# Altium project hardmotor.PrjPcb
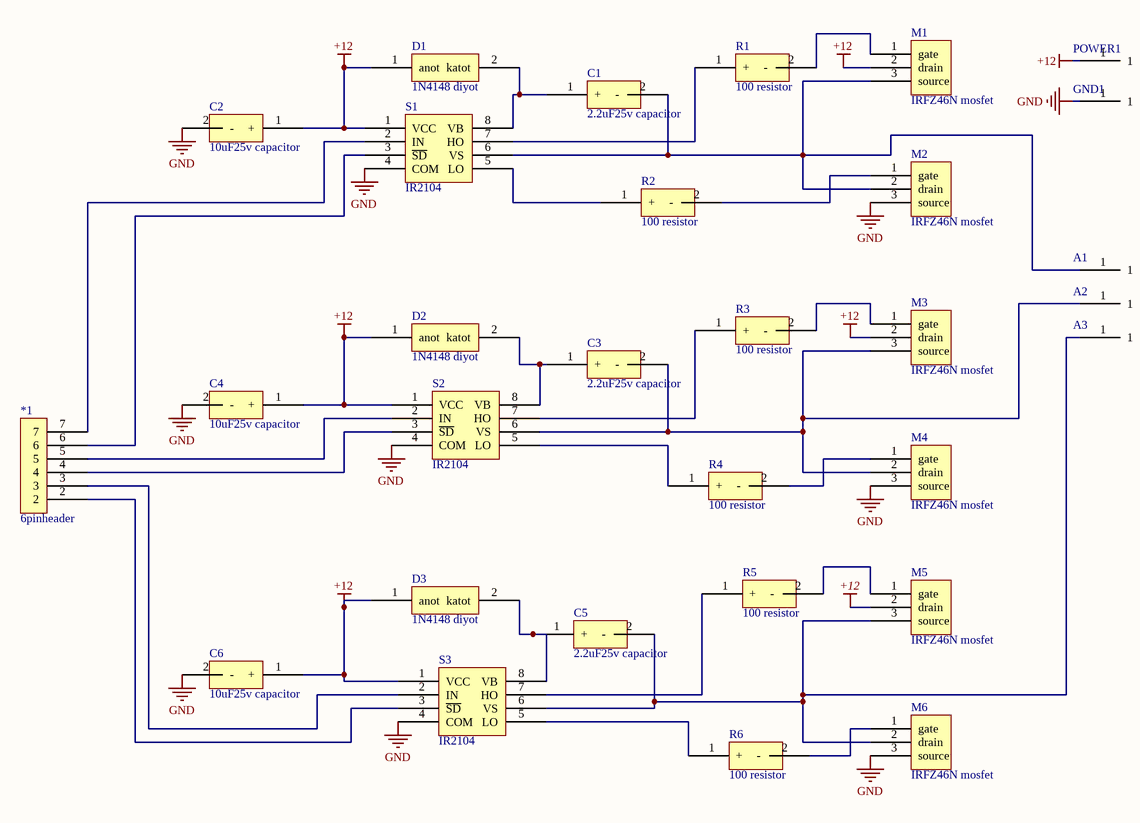
[diagram p0: Sheet1.SchDoc]
1 sheet, 30 parts. Net scope: global (net labels, ports and power ports of the same name join across sheets).
Board file: PCB1.PcbDoc

## Sheet Sheet1.SchDoc
size A4

### Parts
*1  6pinheader  [6pinheader]
A1  (no value)  [1pinheader]
A2  (no value)  [1pinheader]
A3  (no value)  [1pinheader]
C1  2.2uF25v capacitor  [2.2uf25v capacitor]
C2  10uF25v capacitor  [10uf25V capacitor]
C3  2.2uF25v capacitor  [2.2uf25v capacitor]
C4  10uF25v capacitor  [10uf25V capacitor]
C5  2.2uF25v capacitor  [2.2uf25v capacitor]
C6  10uF25v capacitor  [10uf25V capacitor]
D1  1N4148 diyot  [1N4148 diyot]
D2  1N4148 diyot  [1N4148 diyot]
D3  1N4148 diyot  [1N4148 diyot]
GND1  (no value)  [1pinheader]
M1  IRFZ46N mosfet  [IRFZ46N mosfet]
M2  IRFZ46N mosfet  [IRFZ46N mosfet]
M3  IRFZ46N mosfet  [IRFZ46N mosfet]
M4  IRFZ46N mosfet  [IRFZ46N mosfet]
M5  IRFZ46N mosfet  [IRFZ46N mosfet]
M6  IRFZ46N mosfet  [IRFZ46N mosfet]
POWER1  (no value)  [1pinheader]
R1  100 resistor  [100 resistor]
R2  100 resistor  [100 resistor]
R3  100 resistor  [100 resistor]
R4  100 resistor  [100 resistor]
R5  100 resistor  [100 resistor]
R6  100 resistor  [100 resistor]
S1  IR2104  [IR2104 mos sürücü]
S2  IR2104  [IR2104 mos sürücü]
S3  IR2104  [IR2104 mos sürücü]

### Nets
+12: C2.1(+) C4.1(+) C6.1(+) D1.1(anot) D2.1(anot) D3.1(anot) M1.2(drain) M3.2(drain) M5.2(drain) POWER1.1 S1.1(VCC) S2.1(VCC) S3.1(VCC)
GND: C2.2(-) C4.2(-) C6.2(-) GND1.1 M2.3(source) M4.3(source) M6.3(source) S1.4(COM) S2.4(COM) S3.4(COM)
Net*1_2: *1.2 S3.3(~{SD})
Net*1_3: *1.3 S3.2(IN)
Net*1_4: *1.4 S2.3(~{SD})
Net*1_5: *1.5 S2.2(IN)
Net*1_6: *1.6 S1.3(~{SD})
Net*1_7: *1.7 S1.2(IN)
NetA1_1: A1.1 C1.2(-) M1.3(source) M2.2(drain) S1.6(VS)
NetA2_1: A2.1 C3.2(-) M3.3(source) M4.2(drain) S2.6(VS)
NetA3_1: A3.1 C5.2(-) M5.3(source) M6.2(drain) S3.6(VS)
NetC1_1: C1.1(+) D1.2(katot) S1.8(VB)
NetC3_1: C3.1(+) D2.2(katot) S2.8(VB)
NetC5_1: C5.1(+) D3.2(katot) S3.8(VB)
NetM1_1: M1.1(gate) R1.2(-)
NetM2_1: M2.1(gate) R2.2(-)
NetM3_1: M3.1(gate) R3.2(-)
NetM4_1: M4.1(gate) R4.2(-)
NetM5_1: M5.1(gate) R5.2(-)
NetM6_1: M6.1(gate) R6.2(-)
NetR1_1: R1.1(+) S1.7(HO)
NetR2_1: R2.1(+) S1.5(LO)
NetR3_1: R3.1(+) S2.7(HO)
NetR4_1: R4.1(+) S2.5(LO)
NetR5_1: R5.1(+) S3.7(HO)
NetR6_1: R6.1(+) S3.5(LO)

### Library data of the parts
A1-A3 GND1 POWER1 = 1 pin header